# Altium project 1025-风扇.PrjPcb
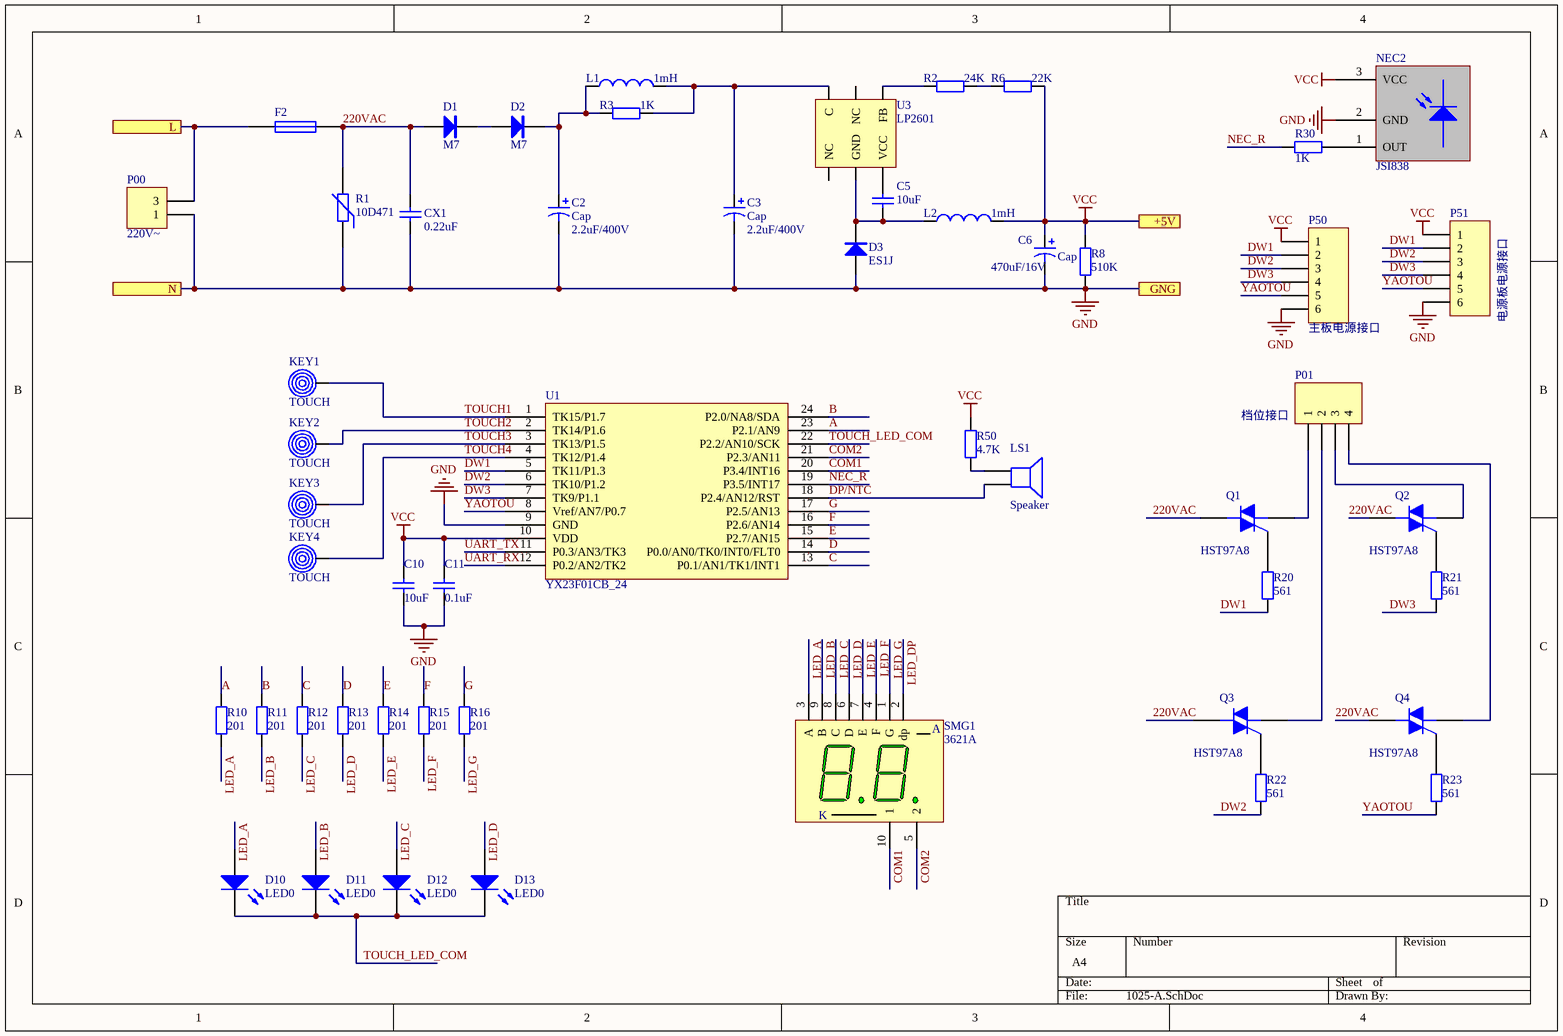
[diagram p0: 1025-A.SchDoc]
1 sheet, 52 parts. Net scope: flat (ports and power ports of the same name join across sheets).
Board files: 1025-one.PcbDoc, 1025_power.PcbDoc, 1025-one-2.PcbDoc

## Sheet 1025-A.SchDoc
size A4

### Parts
C2  Cap  value 2.2uF/400V  [CAE8-3.05]
C3  Cap  value 2.2uF/400V  [CAE8-3.05]
C5  value 10uF  [C 1206_M]  (hidden comment: Cap)
C6  Cap  value 470uF/16V  [CAE8-3.05]
C10  value 10uF  [C 0805_L]  (hidden comment: Cap)
C11  value 0.1uF  [C 0603_L]  (hidden comment: Cap)
CX1  value 0.22uF  [CX2-13*5-10]  (hidden comment: 安规电容)
D1  M7  [D3528]
D2  M7  [D3528]
D3  ES1J  [D3528]
D10  LED0  [LED 0805W]
D11  LED0  [LED 0805W]
D12  LED0  [LED 0805W]
D13  LED0  [LED 0805W]
F2  Fuse 1  [FUSE5.08]  (value not drawn)
KEY1  TOUCH  [KEY-T9-2]
KEY2  TOUCH  [KEY-T9-2]
KEY3  TOUCH  [KEY-T9-2]
KEY4  TOUCH  [KEY-T9-2]
L1  value 1mH  [L15_2]  (hidden comment: Inductor)
L2  value 1mH  [L3]  (hidden comment: Inductor)
LS1  Speaker  [BEEP 4x9x5.5]
NEC2  JSI838  [HS0038B]
P00  220V~  [VH-3AW]
P01  档位接口  [XH-4AW]
P50  主板电源接口  [HDR2.54-LI-6P]
P51  电源板电源接口  [HDR2.54-LI-6P]
Q1  HST97A8  [SOT-89]
Q2  HST97A8  [SOT-89]
Q3  HST97A8  [SOT-89]
Q4  HST97A8  [SOT-89]
R1  10D471  [ZNR7.5]
R2  value 24K  [R 1206-HP_M]  (hidden comment: Res2)
R3  value 1K  [R 1206-HP_M]  (hidden comment: Res2)
R6  value 22K  [R 1206-HP_M]  (hidden comment: Res2)
R8  value 510K  [R 1206-HP_M]  (hidden comment: Res2)
R10  value 201  [R 0603_L]  (hidden comment: Res2)
R11  value 201  [R 0603_L]  (hidden comment: Res2)
R12  value 201  [R 0603_L]  (hidden comment: Res2)
R13  value 201  [R 0603_L]  (hidden comment: Res2)
R14  value 201  [R 0603_L]  (hidden comment: Res2)
R15  value 201  [R 0603_L]  (hidden comment: Res2)
R16  value 201  [R 0603_L]  (hidden comment: Res2)
R20  value 561  [R 1206-HP_M]  (hidden comment: Res2)
R21  value 561  [R 1206-HP_M]  (hidden comment: Res2)
R22  value 561  [R 1206-HP_M]  (hidden comment: Res2)
R23  value 561  [R 1206-HP_M]  (hidden comment: Res2)
R30  value 1K  [R 0603_L]  (hidden comment: Res2)
R50  value 4.7K  [R 0603_L]  (hidden comment: Res2)
SMG1  3621A  [SMG 0.36-2P]
U1  YX23F01CB_24  [SOP24_M]
U3  LP2601

### Ports
+5V, GNG, L, N

### Nets
GND: C2.2 C3.2 C6.2 C10.1 C11.1 CX1.1 D3.A NEC2.2(GND) P00.1 P50.6 P51.6 R1.1 R8.1 U1.9(GND) ; port N, port GNG
VCC: C6.1 C10.2 C11.2 L2.2 NEC2.3(VCC) P50.1 P51.1 R6.2 R8.2 R50.2 U1.10(VDD) ; port +5V
220VAC: CX1.2 D1.A F2.2 Q1.2(T2) Q2.2(T2) Q3.2(T2) Q4.2(T2) R1.2
A: R10.2 U1.23(P2.1/AN9)
B: R11.2 U1.24(P2.0/NA8/SDA)
C: R12.2 U1.13(P0.1/AN1/TK1/INT1)
COM1: SMG1.10(1) U1.20(P3.4/INT16)
COM2: SMG1.5(2) U1.21(P2.3/AN11)
D: R13.2 U1.14(P0.0/AN0/TK0/INT0/FLT0)
DP/NTC: LS1.2 U1.18(P2.4/AN12/RST)
DW1: P50.2 P51.2 R20.1 U1.5(TK11/P1.3)
DW2: P50.3 P51.3 R22.1 U1.6(TK10/P1.2)
DW3: P50.4 P51.4 R21.1 U1.7(TK9/P1.1)
E: R14.2 U1.15(P2.7/AN15)
F: R15.2 U1.16(P2.6/AN14)
G: R16.2 U1.17(P2.5/AN13)
LED_A: D10.1(A) R10.1 SMG1.3(A)
LED_B: D11.1(A) R11.1 SMG1.9(B)
LED_C: D12.1(A) R12.1 SMG1.8(C)
LED_D: D13.1(A) R13.1 SMG1.6(D)
LED_DP: SMG1.2(dp)
LED_E: R14.1 SMG1.7(E)
LED_F: R15.1 SMG1.4(F)
LED_G: R16.1 SMG1.1(G)
NEC_R: R30.2 U1.19(P3.5/INT17)
TOUCH1: KEY1.1 U1.1(TK15/P1.7)
TOUCH2: KEY2.1 U1.2(TK14/P1.6)
TOUCH3: KEY3.1 U1.3(TK13/P1.5)
TOUCH4: KEY4.1 U1.4(TK12/P1.4)
TOUCH_LED_COM: D10.2(K) D11.2(K) D12.2(K) D13.2(K) U1.22(P2.2/AN10/SCK)
UART_RX: U1.12(P0.2/AN2/TK2)
UART_TX: U1.11(P0.3/AN3/TK3)
YAOTOU: P50.5 P51.5 R23.1 U1.8(Vref/AN7/P0.7)
NetC2_1: C2.1 D2.K L1.1 R3.1
NetC3_1: C3.1 L1.2 R3.2 U3.4(C)
NetC5_1: C5.1 D3.K L2.1 U3.2(GND)
NetC5_2: C5.2 U3.1(VCC)
NetD1_K: D1.K D2.A
NetF2_1: F2.1 P00.3 ; port L
NetLS1_1: LS1.1 R50.1
NetNEC2_1: NEC2.1(OUT) R30.1
NetP01_1: P01.1 Q1.1(T1)
NetP01_2: P01.2 Q3.1(T1)
NetP01_3: P01.3 Q2.1(T1)
NetP01_4: P01.4 Q4.1(T1)
NetQ1_3: Q1.3(G) R20.2
NetQ2_3: Q2.3(G) R21.2
NetQ3_3: Q3.3(G) R22.2
NetQ4_3: Q4.3(G) R23.2
NetR2_1: R2.1 U3.6(FB)
NetR2_2: R2.2 R6.1

Not connected (* = marked no-connect by the designer): U3 3(NC) 5(NC)

### Notes on the sheet
- (in symbol 3621A) K

### Library data of the parts
C2 C3 C6 = Cap Pol1: Polarized Capacitor (Radial); Published: 8-Jun-2000; LatestRevisionDate: 17-Jul-2002; LatestRevisionNote: Re-released for DXP Platform.; PackageReference: RB7.6-15; Publisher: Altium Limited; PackageDescription: Polarized Capacitor (Radial); 2 Leads
C5 C10 C11 = Cap: Capacitor; Published: 8-Jun-2000; LatestRevisionDate: 17-Jul-2002; LatestRevisionNote: Re-released for DXP Platform.; PackageReference: RAD-0.3; Publisher: Altium Limited; PackageDescription: Radial Cap, Thru-Hole; 2 Leads; 0.3 in Pin Spacing
CX1 = Cap: 安规Capacitor; Published: 8-Jun-2000; LatestRevisionDate: 17-Jul-2002; LatestRevisionNote: Re-released for DXP Platform.; PackageReference: RAD-0.3; Publisher: Altium Limited; PackageDescription: Radial Cap, Thru-Hole; 2 Leads; 0.3 in Pin Spacing
D1 D2 = M7: 整流二极管; 版权归属: 封装库来自淘宝 ID：黄晶宝石; BOM名称: 整流二极管; 学习资源: https://shop463601444.taobao.com
D3 = M7: 快速二极管; BOM名称: 整流二极管; 版权归属: 封装库来自淘宝 ID：黄晶宝石; 学习资源: https://shop463601444.taobao.com
D10-D13 = LED0: Typical INFRARED GaAs LED; Published: 8-Jun-2000; LatestRevisionDate: 08-Jul-2005; LatestRevisionNote: Mech Layer 1 removed.; PackageReference: LED-0; Publisher: Altium Limited; PackageDescription: LED; 2 Leads
F2 = Fuse 1: Fuse; Published: 8-Jun-2000; LatestRevisionDate: 17-Jul-2002; LatestRevisionNote: Re-released for DXP Platform.; PackageReference: PIN-W2/E2.8; Publisher: Altium Limited; PackageDescription: Thru-Hole; 2 Leads
KEY1-KEY4 = TOUCH: 触摸弹簧
L1 L2 = Inductor: Code_IEC: 1005; Published: 8-Jun-2000; LatestRevisionDate: 29-May-2009; LatestRevisionNote: IPC-7351 Footprint Added.; PackageReference: 0402-A; Publisher: Altium Limited; PackageDescription: Chip Inductor; Code_JEITA: 0402
LS1 = Speaker: Loudspeaker; Published: 24-Mar-1999; LatestRevisionDate: 17-Jul-2002; LatestRevisionNote: Re-released for DXP Platform.; PackageReference: PIN2; Publisher: Altium Limited
NEC2 = HS0038: 红外接收器
P00 = Header 2: Header, 2-Pin; LatestRevisionDate: 17-Jul-2002; LatestRevisionNote: Re-released for DXP Platform.; Publisher: Altium Limited
P01 = Header 4: Header, 4-Pin; LatestRevisionDate: 17-Jul-2002; LatestRevisionNote: Re-released for DXP Platform.; Publisher: Altium Limited
P50 P51 = Header 6: Header, 6-Pin; LatestRevisionDate: 17-Jul-2002; LatestRevisionNote: Re-released for DXP Platform.; Publisher: Altium Limited
Q1-Q4 = Triac: Silicon Bidirectional Triode Thyristor; Note: Pin 2 is electrically connected to Pin 4 (TAB); Published: 29-Sep-2000; LatestRevisionDate: 17-Jul-2002; LatestRevisionNote: Re-released for DXP Platform.; DatasheetVersion: 1999; PackageReference: 369-03; Publisher: Altium Limited; PackageDescription: TO, Thru-Hole, Vertical, Heatsink Mounted; 3 In-Line Leads; Pitch 2.28 mm; ComponentLink1Description: Manufacturer Link; ComponentLink1URL: http://www.motorola.com/
R1 = Res Varistor: Varistor (Voltage-Sensitive Resistor); Published: 24-Mar-1999; LatestRevisionDate: 29-May-2009; LatestRevisionNote: IPC-7351 Footprint Added.; PackageVersion: Mar-2003; PackageReference: 6-0805; Publisher: Altium Limited; PackageDescription: Chip Resistor 0805 Case Size; Code_IPC: RESC2012
R2 R3 R6 R8 R10-R16 R20-R23 R30 R50 = Res2: Resistor; Published: 8-Jun-2000; LatestRevisionDate: 17-Jul-2002; LatestRevisionNote: Re-released for DXP Platform.; PackageReference: AXIAL-0.4; Publisher: Altium Limited; PackageDescription: Axial Device, Thru-Hole; 2 Leads; 0.4 in Pin Spacing
SMG1 = 3621A: 0.36寸2位共阴数码管; 版权归属: 封装库来自淘宝 ID：黄晶宝石; BOM名称: 0.36寸2位共阴; 学习资源: https://shop463601444.taobao.com
U1 = YX23F01CB_24: 主控MCU